# Altium project Analog_SMD_Final.PrjPcb
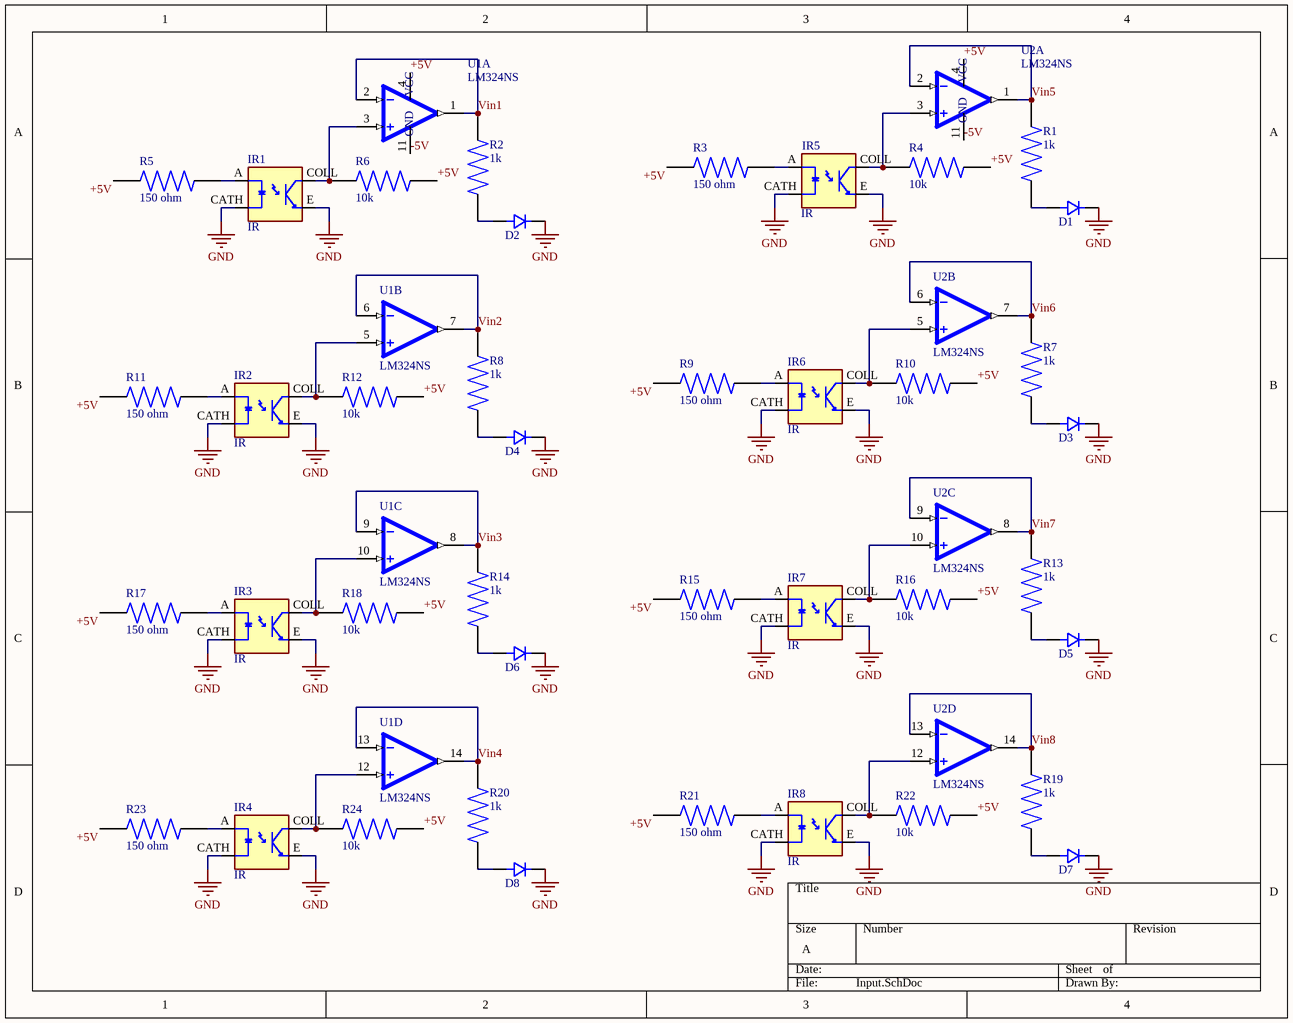
[diagram p0: Input.SchDoc]
6 sheets, 113 parts. Net scope: global (net labels, ports and power ports of the same name join across sheets).
Board file: PCB1.PcbDoc
Sheets:
  Input.SchDoc
  Error_Generator.SchDoc
  PID.SchDoc
  Triangular_Wave.SchDoc
  Motor_Driver.SchDoc
  Regulators.SchDoc

## Sheet Input.SchDoc
size A; SheetNumber: 1; SheetTotal: 6

### Parts
D1  150080RS75000  [150080RS75000]  (value not drawn)
D2  150080RS75000  [150080RS75000]  (value not drawn)
D3  150080RS75000  [150080RS75000]  (value not drawn)
D4  150080RS75000  [150080RS75000]  (value not drawn)
D5  150080RS75000  [150080RS75000]  (value not drawn)
D6  150080RS75000  [150080RS75000]  (value not drawn)
D7  150080RS75000  [150080RS75000]  (value not drawn)
D8  150080RS75000  [150080RS75000]  (value not drawn)
IR1  IR  [OPTO_TCRT5000]
IR2  IR  [OPTO_TCRT5000]
IR3  IR  [OPTO_TCRT5000]
IR4  IR  [OPTO_TCRT5000]
IR5  IR  [OPTO_TCRT5000]
IR6  IR  [OPTO_TCRT5000]
IR7  IR  [OPTO_TCRT5000]
IR8  IR  [OPTO_TCRT5000]
R1  1k  [RESC2012X60N]
R2  1k  [RESC2012X60N]
R3  150 ohm  [RESC2012X60N]
R4  10k  [RESC2012X60N]
R5  150 ohm  [RESC2012X60N]
R6  10k  [RESC2012X60N]
R7  1k  [RESC2012X60N]
R8  1k  [RESC2012X60N]
R9  150 ohm  [RESC2012X60N]
R10  10k  [RESC2012X60N]
R11  150 ohm  [RESC2012X60N]
R12  10k  [RESC2012X60N]
R13  1k  [RESC2012X60N]
R14  1k  [RESC2012X60N]
R15  150 ohm  [RESC2012X60N]
R16  10k  [RESC2012X60N]
R17  150 ohm  [RESC2012X60N]
R18  10k  [RESC2012X60N]
R19  1k  [RESC2012X60N]
R20  1k  [RESC2012X60N]
R21  150 ohm  [RESC2012X60N]
R22  10k  [RESC2012X60N]
R23  150 ohm  [RESC2012X60N]
R24  10k  [RESC2012X60N]
U1  LM324NS  [SOIC127P780X200-14N]  (parts A,B,C,D of 4)
U2  LM324NS  [SOIC127P780X200-14N]  (parts A,B,C,D of 4)

### Nets
GND: D1.2 D2.2 D3.2 D4.2 D5.2 D6.2 D7.2 D8.2 IR1.CATH IR1.E IR2.CATH IR2.E IR3.CATH IR3.E IR4.CATH IR4.E IR5.CATH IR5.E IR6.CATH IR6.E IR7.CATH IR7.E IR8.CATH IR8.E
+5V: R3.1 R4.2 R5.1 R6.2 R9.1 R10.2 R11.1 R12.2 R15.1 R16.2 R17.1 R18.2 R21.1 R22.2 R23.1 R24.2 U1.4(VCC) U2.4(VCC)
-5V: U1.11(GND) U2.11(GND)
Vin1: R2.2 U1.1(1OUT) U1.2(1IN-)
Vin2: R8.2 U1.6(2IN-) U1.7(2OUT)
Vin3: R14.2 U1.8(3OUT) U1.9(3IN-)
Vin4: R20.2 U1.13(4IN-) U1.14(4OUT)
Vin5: R1.2 U2.1(1OUT) U2.2(1IN-)
Vin6: R7.2 U2.6(2IN-) U2.7(2OUT)
Vin7: R13.2 U2.8(3OUT) U2.9(3IN-)
Vin8: R19.2 U2.13(4IN-) U2.14(4OUT)
NetD1_1: D1.1 R1.1
NetD2_1: D2.1 R2.1
NetD3_1: D3.1 R7.1
NetD4_1: D4.1 R8.1
NetD5_1: D5.1 R13.1
NetD6_1: D6.1 R14.1
NetD7_1: D7.1 R19.1
NetD8_1: D8.1 R20.1
NetIR1_A: IR1.A R5.2
NetIR1_COLL: IR1.COLL R6.1 U1.3(1IN+)
NetIR2_A: IR2.A R11.2
NetIR2_COLL: IR2.COLL R12.1 U1.5(2IN+)
NetIR3_A: IR3.A R17.2
NetIR3_COLL: IR3.COLL R18.1 U1.10(3IN+)
NetIR4_A: IR4.A R23.2
NetIR4_COLL: IR4.COLL R24.1 U1.12(4IN+)
NetIR5_A: IR5.A R3.2
NetIR5_COLL: IR5.COLL R4.1 U2.3(1IN+)
NetIR6_A: IR6.A R9.2
NetIR6_COLL: IR6.COLL R10.1 U2.5(2IN+)
NetIR7_A: IR7.A R15.2
NetIR7_COLL: IR7.COLL R16.1 U2.10(3IN+)
NetIR8_A: IR8.A R21.2
NetIR8_COLL: IR8.COLL R22.1 U2.12(4IN+)

### Library data of the parts
IR1-IR8 = IR: 950 nm 60 mA Through Hole Reflective Optical Sensor with Transistor Output; TCRT5000; Availability: Unavailable; MP: TCRT5000; Value: *; Price: None; Package: None
R1 R2 R7 R8 R13 R14 R19 R20 = 1k: 1 kOhms Â±1% 0.125W, 1/8W Chip Resistor 0805 (2012 Metric) Moisture Resistant Thick Film; RC0805FR-071KL; MF: Yageo; DigiKey_Part_Number: 311-1.00KCRTR-ND; Purchase-URL: https://pricing.snapeda.com/search?q=RC0805FR-071KL&ref=eda; Package: 2012 Yageo; Check_prices: https://www.snapeda.com/parts/RC0805FR-071KL/Yageo/view-part/?ref=eda; Value: *; SnapEDA_Link: https://www.snapeda.com/parts/RC0805FR-071KL/Yageo/view-part/?ref=snap; MP: RC0805FR-071KL
R3 R5 R9 R11 R15 R17 R21 R23 = 150 ohm: 150 Ohms Â±1% 0.125W, 1/8W Chip Resistor 0805 (2012 Metric) Moisture Resistant Thick Film; RC0805FR-07150RL; MF: Yageo; SnapEDA_Link: https://www.snapeda.com/parts/RC0805FR-07150RL/Yageo/view-part/?ref=snap; Package: 2012 Yageo; Value: *; MP: RC0805FR-07150RL; Check_prices: https://www.snapeda.com/parts/RC0805FR-07150RL/Yageo/view-part/?ref=eda
R4 R6 R10 R12 R16 R18 R22 R24 = 10k: 10 kOhms Â±1% 0.125W, 1/8W Chip Resistor 0805 (2012 Metric) Moisture Resistant Thick Film; RC0805FR-0710KL; MF: Yageo; Value: *; SnapEDA_Link: https://www.snapeda.com/parts/RC0805FR-0710KL/Yageo/view-part/?ref=snap; Purchase-URL: https://pricing.snapeda.com/search/part/RC0805FR-0710KL/?ref=eda; Availability: In Stock; Price: None; Package: 2012 Rohm Semiconductor; Check_prices: https://www.snapeda.com/parts/RC0805FR-0710KL/Yageo/view-part/?ref=eda; MP: RC0805FR-0710KL
U1 U2 = LM324NS: 4-Channel industry standard operational amplifier 14-SO 0 to 70; LM324NSRG4; MF: Texas Instruments; Purchase-URL: https://pricing.snapeda.com/search/part/LM324NSRG4/?ref=eda; MP: LM324NSRG4; SnapEDA_Link: https://www.snapeda.com/parts/LM324NSRG4/Texas+Instruments/view-part/?ref=snap; Value: *; Package: SOP-14 Texas Instruments; Price: None; Availability: In Stock; Check_prices: https://www.snapeda.com/parts/LM324NSRG4/Texas+Instruments/view-part/?ref=eda

## Sheet Error_Generator.SchDoc
size A; SheetNumber: 2; SheetTotal: 6
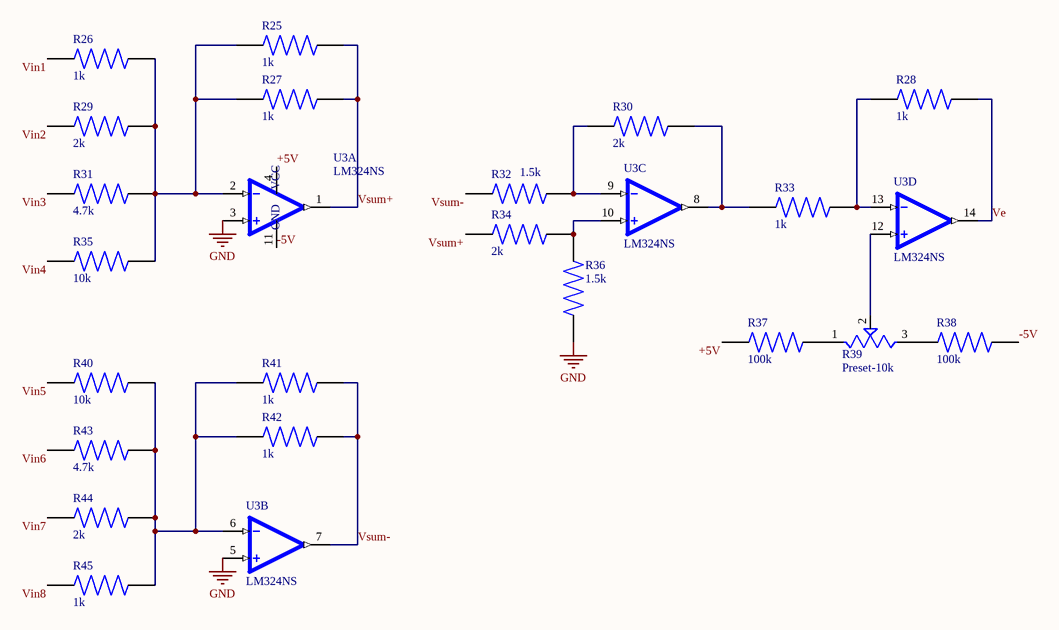
[diagram p1: Error_Generator.SchDoc]

### Parts
R25  1k  [RESC2012X60N]
R26  1k  [RESC2012X60N]
R27  1k  [RESC2012X60N]
R28  1k  [RESC2012X60N]
R29  2k  [RESC2012X60N]
R30  2k  [RESC2012X60N]
R31  4.7k  [RESC2012X60N]
R32  1.5k  [RESC2012X60N]
R33  1k  [RESC2012X60N]
R34  2k  [RESC2012X60N]
R35  10k  [RESC2012X60N]
R36  1.5k  [RESC2012X60N]
R37  100k  [RESC2012X60N]
R38  100k  [RESC2012X60N]
R39  Preset-10k  [TRIM_3306F-1-103]
R40  10k  [RESC2012X60N]
R41  1k  [RESC2012X60N]
R42  1k  [RESC2012X60N]
R43  4.7k  [RESC2012X60N]
R44  2k  [RESC2012X60N]
R45  1k  [RESC2012X60N]
U3  LM324NS  [SOIC127P780X200-14N]  (parts A,B,C,D of 4)

### Nets
GND: R36.1 U3.3(1IN+) U3.5(2IN+)
+5V: R37.1 U3.4(VCC)
-5V: R38.2 U3.11(GND)
Ve: R28.2 U3.14(4OUT)
Vin1: R26.1
Vin2: R29.1
Vin3: R31.1
Vin4: R35.1
Vin5: R40.1
Vin6: R43.1
Vin7: R44.1
Vin8: R45.1
Vsum+: R25.2 R27.2 R34.1 U3.1(1OUT)
Vsum-: R32.1 R41.2 R42.2 U3.7(2OUT)
NetR25_1: R25.1 R26.2 R27.1 R29.2 R31.2 R35.2 U3.2(1IN-)
NetR28_1: R28.1 R33.2 U3.13(4IN-)
NetR30_1: R30.1 R32.2 U3.9(3IN-)
NetR30_2: R30.2 R33.1 U3.8(3OUT)
NetR34_2: R34.2 R36.2 U3.10(3IN+)
NetR37_2: R37.2 R39.1(CCW)
NetR38_1: R38.1 R39.3(CW)
NetR39_2: R39.2(W) U3.12(4IN+)
NetR40_2: R40.2 R41.1 R42.1 R43.2 R44.2 R45.2 U3.6(2IN-)

### Library data of the parts
R25-R28 R33 R41 R42 R45 = 1k: as R1 on sheet Input; DigiKey_Part_Number: 311-1.00KCRTR-ND; Purchase-URL: https://pricing.snapeda.com/search?q=RC0805FR-071KL&ref=eda; Package: 2012 Yageo; Check_prices: https://www.snapeda.com/parts/RC0805FR-071KL/Yageo/view-part/?ref=eda; Value: *; SnapEDA_Link: https://www.snapeda.com/parts/RC0805FR-071KL/Yageo/view-part/?ref=snap; MP: RC0805FR-071KL
R29 R30 R34 R44 = 2k: 2 kOhms Â±1% 0.125W, 1/8W Chip Resistor 0805 (2012 Metric) Moisture Resistant Thick Film; RC0805FR-072KL; MF: Yageo; SnapEDA_Link: https://www.snapeda.com/parts/RC0805FR-072KL/Yageo/view-part/?ref=snap; Package: 2012 Yageo; Value: *; MP: RC0805FR-072KL; Check_prices: https://www.snapeda.com/parts/RC0805FR-072KL/Yageo/view-part/?ref=eda
R31 R43 = 4.7k: 4.7 kOhms Â±1% 0.125W, 1/8W Chip Resistor 0805 (2012 Metric) Moisture Resistant Thick Film; RC0805FR-074K7L; MF: Yageo; Check_prices: https://www.snapeda.com/parts/RC0805FR-074K7L/Yageo/view-part/?ref=eda; Value: *; Availability: In Stock; MP: RC0805FR-074K7L; Price: None; Package: 2012 Rohm Semiconductor; SnapEDA_Link: https://www.snapeda.com/parts/RC0805FR-074K7L/Yageo/view-part/?ref=snap; Purchase-URL: https://pricing.snapeda.com/search/part/RC0805FR-074K7L/?ref=eda
R32 R36 = 1.5k: Res Thin Film 0805 1.5K Ohm 0.1% 0.125W(1/8W) Â±25ppm/C Epoxy Pad SMD T/R; RT0805BRD071K5L; MF: Yageo; SnapEDA_Link: https://www.snapeda.com/parts/RT0805BRD071K5L/Yageo/view-part/?ref=snap; Package: 2012 Yageo; Value: *; MP: RT0805BRD071K5L; Check_prices: https://www.snapeda.com/parts/RT0805BRD071K5L/Yageo/view-part/?ref=eda
R35 R40 = 10k: as R4 on sheet Input; Value: *; SnapEDA_Link: https://www.snapeda.com/parts/RC0805FR-0710KL/Yageo/view-part/?ref=snap; Purchase-URL: https://pricing.snapeda.com/search/part/RC0805FR-0710KL/?ref=eda; Availability: In Stock; Price: None; Package: 2012 Rohm Semiconductor; Check_prices: https://www.snapeda.com/parts/RC0805FR-0710KL/Yageo/view-part/?ref=eda; MP: RC0805FR-0710KL
R37 R38 = 100k: 100 kOhms Â±1% 0.125W, 1/8W Chip Resistor 0805 (2012 Metric) Moisture Resistant Thick Film; RC0805FR-07100KL; MF: Yageo; SnapEDA_Link: https://www.snapeda.com/parts/RC0805FR-07100KL/Yageo/view-part/?ref=snap; Package: 2012 Yageo; Value: *; MP: RC0805FR-07100KL; Check_prices: https://www.snapeda.com/parts/RC0805FR-07100KL/Yageo/view-part/?ref=eda
R39 = Preset: TRIMMER - 6MM ROUND, SINGLE-TURN,CERMET, 10K OHMS | Bourns 3306F-1-103; SnapEDA_Link: https://www.snapeda.com/parts/3306F-1-103/Bourns/view-part/?ref=snap; Package: 3306F Bourns; Value: *; MF: Bourns; MP: 3306F-1-103; Check_prices: https://www.snapeda.com/parts/3306F-1-103/Bourns/view-part/?ref=eda
U3 = LM324NS: as U1 on sheet Input; Purchase-URL: https://pricing.snapeda.com/search/part/LM324NSRG4/?ref=eda; MP: LM324NSRG4; SnapEDA_Link: https://www.snapeda.com/parts/LM324NSRG4/Texas+Instruments/view-part/?ref=snap; Value: *; Package: SOP-14 Texas Instruments; Price: None; Availability: In Stock; Check_prices: https://www.snapeda.com/parts/LM324NSRG4/Texas+Instruments/view-part/?ref=eda

## Sheet PID.SchDoc
size A; SheetNumber: 3; SheetTotal: 6
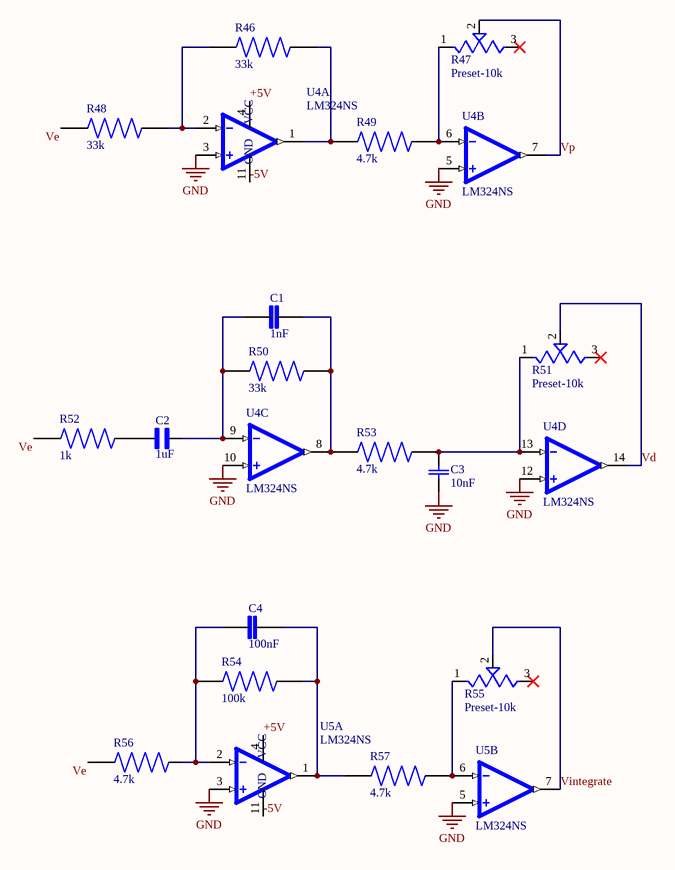
[diagram p2: PID.SchDoc]

### Parts
C1  1nF  [CAPC2012X70]
C2  1uF  [CAPC2012X135N]
C3  10nF  [CAPC2013X110N]
C4  100nF  [CAPC2012X70]
R46  33k  [RESC2012X60N]
R47  Preset-10k  [TRIM_3306F-1-103]
R48  33k  [RESC2012X60N]
R49  4.7k  [RESC2012X60N]
R50  33k  [RESC2012X60N]
R51  Preset-10k  [TRIM_3306F-1-103]
R52  1k  [RESC2012X60N]
R53  4.7k  [RESC2012X60N]
R54  100k  [RESC2012X60N]
R55  Preset-10k  [TRIM_3306F-1-103]
R56  4.7k  [RESC2012X60N]
R57  4.7k  [RESC2012X60N]
U4  LM324NS  [SOIC127P780X200-14N]  (parts A,B,C,D of 4)
U5  LM324NS  [SOIC127P780X200-14N]  (parts A,B of 4)

### Nets
GND: C3.1(C1) U4.3(1IN+) U4.5(2IN+) U4.10(3IN+) U4.12(4IN+) U5.3(1IN+) U5.5(2IN+)
+5V: U4.4(VCC) U5.4(VCC)
-5V: U4.11(GND) U5.11(GND)
Vd: R51.2(W) U4.14(4OUT)
Ve: R48.1 R52.1 R56.1
Vintegrate: R55.2(W) U5.7(2OUT)
Vp: R47.2(W) U4.7(2OUT)
NetC1_1: C1.1 C2.1 R50.1 U4.9(3IN-)
NetC1_2: C1.2 R50.2 R53.1 U4.8(3OUT)
NetC2_2: C2.2 R52.2
NetC3_2: C3.2(C2) R51.1(CCW) R53.2 U4.13(4IN-)
NetC4_1: C4.1 R54.1 R56.2 U5.2(1IN-)
NetC4_2: C4.2 R54.2 R57.1 U5.1(1OUT)
NetR46_1: R46.1 R48.2 U4.2(1IN-)
NetR46_2: R46.2 R49.1 U4.1(1OUT)
NetR47_1: R47.1(CCW) R49.2 U4.6(2IN-)
NetR55_1: R55.1(CCW) R57.2 U5.6(2IN-)

Not connected (* = marked no-connect by the designer): R47 3(CW)*; R51 3(CW)*; R55 3(CW)*

### Library data of the parts
C1 C4 = 1nF: 1000 pF Â±10% 50V Ceramic Capacitor X7R 0805 (2012 Metric); CC0805KRX7R9BB102; MF: Yageo; SnapEDA_Link: https://www.snapeda.com/parts/CC0805KRX7R9BB102/Yageo/view-part/?ref=snap; Package: 0805 Yageo; Value: *; MP: CC0805KRX7R9BB102; Check_prices: https://www.snapeda.com/parts/CC0805KRX7R9BB102/Yageo/view-part/?ref=eda
C2 = 1uF: SMD Capacitor X7R(EIA) with Capacitance: 1.0uF Tol. 10%. Rated Voltage: 25Vdc; GRM21BR71E105KA99L; MF: Murata; SnapEDA_Link: https://www.snapeda.com/parts/GRM21BR71E105KA99L/Murata/view-part/?ref=snap; Package: 2012 Murata; Value: *; MP: GRM21BR71E105KA99L; Check_prices: https://www.snapeda.com/parts/GRM21BR71E105KA99L/Murata/view-part/?ref=eda
C3 = 10nF: 10000 pF Â±10% 50V Ceramic Capacitor X7R 0805 (2012 Metric); CC0805KRX7R9BB103; MF: Yageo; SnapEDA_Link: https://www.snapeda.com/parts/CC0805KRX7R9BB103/Yageo/view-part/?ref=snap; Package: 0805 Yageo; Value: *; MP: CC0805KRX7R9BB103; Check_prices: https://www.snapeda.com/parts/CC0805KRX7R9BB103/Yageo/view-part/?ref=eda
R46 R48 R50 = 33k: 33 kOhms Â±1% 0.125W, 1/8W Chip Resistor 0805 (2012 Metric) Moisture Resistant Thick Film; RC0805FR-0733KL; MF: Yageo; SnapEDA_Link: https://www.snapeda.com/parts/RC0805FR-0733KL/Yageo/view-part/?ref=snap; Package: 2012 Yageo; Value: *; MP: RC0805FR-0733KL; Check_prices: https://www.snapeda.com/parts/RC0805FR-0733KL/Yageo/view-part/?ref=eda
R47 R51 R55 = Preset: as R39 on sheet Error_Generator; SnapEDA_Link: https://www.snapeda.com/parts/3306F-1-103/Bourns/view-part/?ref=snap; Package: 3306F Bourns; Value: *; MF: Bourns; MP: 3306F-1-103; Check_prices: https://www.snapeda.com/parts/3306F-1-103/Bourns/view-part/?ref=eda
R49 R53 R56 R57 = 4.7k: as R31 on sheet Error_Generator; Check_prices: https://www.snapeda.com/parts/RC0805FR-074K7L/Yageo/view-part/?ref=eda; Value: *; Availability: In Stock; MP: RC0805FR-074K7L; Price: None; Package: 2012 Rohm Semiconductor; SnapEDA_Link: https://www.snapeda.com/parts/RC0805FR-074K7L/Yageo/view-part/?ref=snap; Purchase-URL: https://pricing.snapeda.com/search/part/RC0805FR-074K7L/?ref=eda
R52 = 1k: as R1 on sheet Input; DigiKey_Part_Number: 311-1.00KCRTR-ND; Purchase-URL: https://pricing.snapeda.com/search?q=RC0805FR-071KL&ref=eda; Package: 2012 Yageo; Check_prices: https://www.snapeda.com/parts/RC0805FR-071KL/Yageo/view-part/?ref=eda; Value: *; SnapEDA_Link: https://www.snapeda.com/parts/RC0805FR-071KL/Yageo/view-part/?ref=snap; MP: RC0805FR-071KL
R54 = 100k: as R37 on sheet Error_Generator; SnapEDA_Link: https://www.snapeda.com/parts/RC0805FR-07100KL/Yageo/view-part/?ref=snap; Package: 2012 Yageo; Value: *; MP: RC0805FR-07100KL; Check_prices: https://www.snapeda.com/parts/RC0805FR-07100KL/Yageo/view-part/?ref=eda
U4 U5 = LM324NS: as U1 on sheet Input; Purchase-URL: https://pricing.snapeda.com/search/part/LM324NSRG4/?ref=eda; MP: LM324NSRG4; SnapEDA_Link: https://www.snapeda.com/parts/LM324NSRG4/Texas+Instruments/view-part/?ref=snap; Value: *; Package: SOP-14 Texas Instruments; Price: None; Availability: In Stock; Check_prices: https://www.snapeda.com/parts/LM324NSRG4/Texas+Instruments/view-part/?ref=eda

## Sheet Triangular_Wave.SchDoc
size A; SheetNumber: 4; SheetTotal: 6
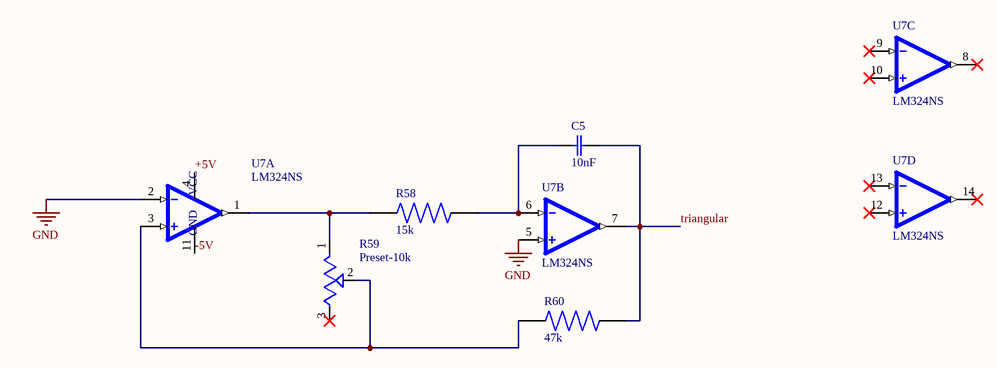
[diagram p3: Triangular_Wave.SchDoc]

### Parts
C5  10nF  [CAPC2013X110N]
R58  15k  [RES_ERA6ARB153V]
R59  Preset-10k  [TRIM_3306F-1-103]
R60  47k  [RESC2012X60N]
U7  LM324NS  [SOIC127P780X200-14N]  (parts A,B,C,D of 4)

### Nets
GND: U7.2(1IN-) U7.5(2IN+)
+5V: U7.4(VCC)
-5V: U7.11(GND)
triangular: C5.2(C2) R60.2 U7.7(2OUT)
NetC5_1: C5.1(C1) R58.2 U7.6(2IN-)
NetR58_1: R58.1 R59.1(CCW) U7.1(1OUT)
NetR59_2: R59.2(W) R60.1 U7.3(1IN+)

Not connected (* = marked no-connect by the designer): R59 3(CW)*; U7 8(3OUT)* 9(3IN-)* 10(3IN+)* 12(4IN+)* 13(4IN-)* 14(4OUT)*

### Library data of the parts
C5 = 10nF: as C3 on sheet PID; SnapEDA_Link: https://www.snapeda.com/parts/CC0805KRX7R9BB103/Yageo/view-part/?ref=snap; Package: 0805 Yageo; Value: *; MP: CC0805KRX7R9BB103; Check_prices: https://www.snapeda.com/parts/CC0805KRX7R9BB103/Yageo/view-part/?ref=eda
R58 = 15k: ERA6ARB153V; Availability: Unavailable; Price: None; Package: None; Value: *; MP: ERA6ARB153V
R59 = Preset: as R39 on sheet Error_Generator; SnapEDA_Link: https://www.snapeda.com/parts/3306F-1-103/Bourns/view-part/?ref=snap; Package: 3306F Bourns; Value: *; MF: Bourns; MP: 3306F-1-103; Check_prices: https://www.snapeda.com/parts/3306F-1-103/Bourns/view-part/?ref=eda
R60 = 47k: 47 kOhms Â±1% 0.125W, 1/8W Chip Resistor 0805 (2012 Metric) Moisture Resistant Thick Film; RC0805FR-0747KL; MF: Yageo; SnapEDA_Link: https://www.snapeda.com/parts/RC0805FR-0747KL/Yageo/view-part/?ref=snap; Package: 2012 Yageo; Value: *; MP: RC0805FR-0747KL; Check_prices: https://www.snapeda.com/parts/RC0805FR-0747KL/Yageo/view-part/?ref=eda
U7 = LM324NS: as U1 on sheet Input; Purchase-URL: https://pricing.snapeda.com/search/part/LM324NSRG4/?ref=eda; MP: LM324NSRG4; SnapEDA_Link: https://www.snapeda.com/parts/LM324NSRG4/Texas+Instruments/view-part/?ref=snap; Value: *; Package: SOP-14 Texas Instruments; Price: None; Availability: In Stock; Check_prices: https://www.snapeda.com/parts/LM324NSRG4/Texas+Instruments/view-part/?ref=eda

## Sheet Motor_Driver.SchDoc
size A; SheetNumber: 5; SheetTotal: 6
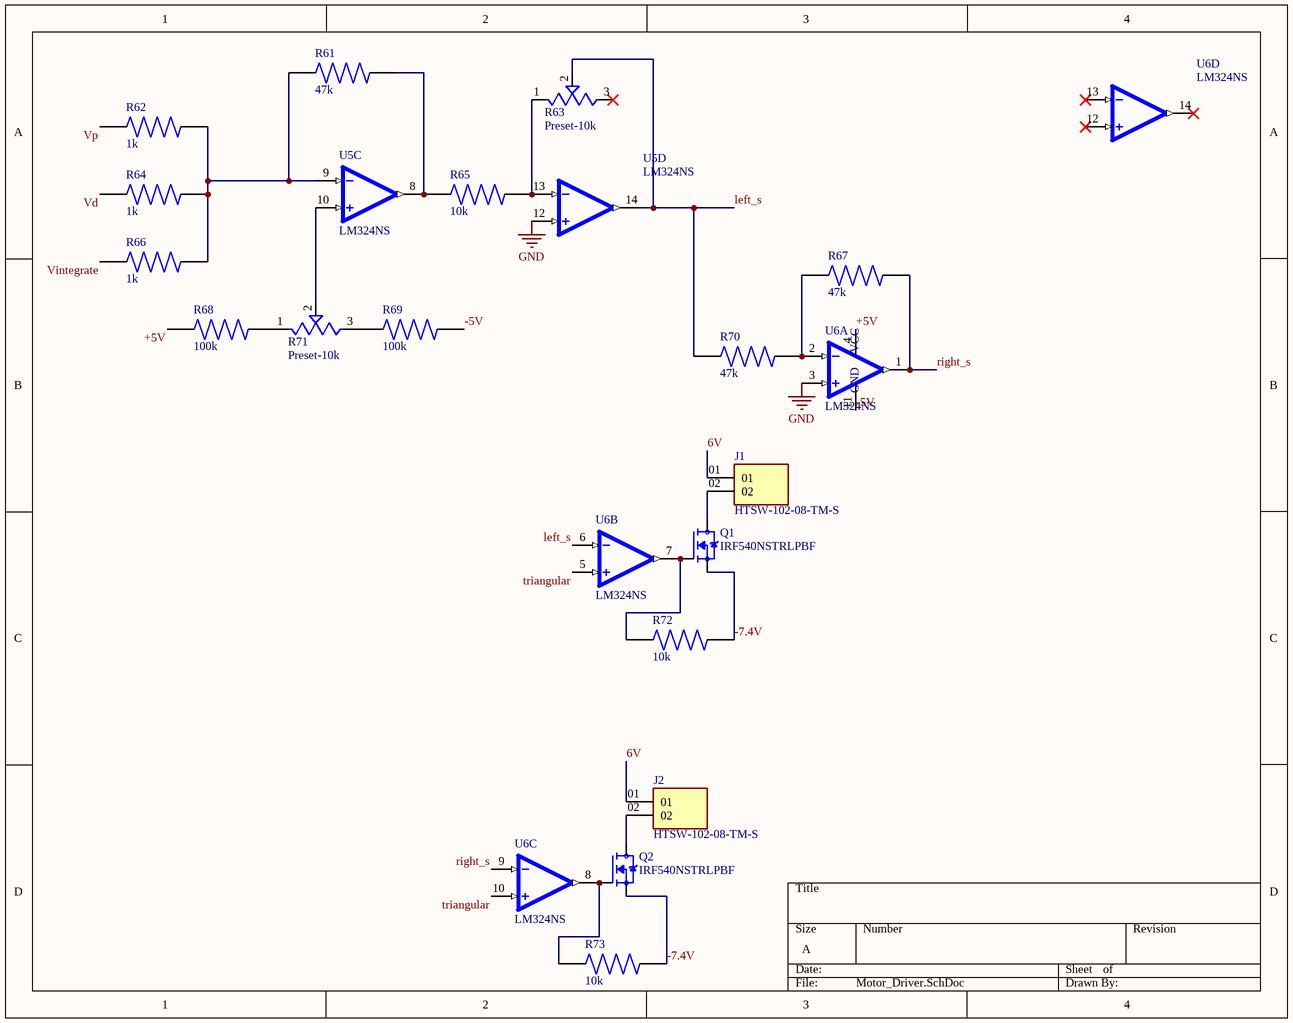
[diagram p4: Motor_Driver.SchDoc]

### Parts
J1  HTSW-102-08-TM-S  [SAMTEC_HTSW-102-08-TM-S]
J2  HTSW-102-08-TM-S  [SAMTEC_HTSW-102-08-TM-S]
Q1  IRF540NSTRLPBF  [TRANS_IRF540NSTRLPBF]
Q2  IRF540NSTRLPBF  [TRANS_IRF540NSTRLPBF]
R61  47k  [RESC2012X60N]
R62  1k  [RESC2012X60N]
R63  Preset-10k  [TRIM_3306F-1-103]
R64  1k  [RESC2012X60N]
R65  10k  [RESC2012X60N]
R66  1k  [RESC2012X60N]
R67  47k  [RESC2012X60N]
R68  100k  [RESC2012X60N]
R69  100k  [RESC2012X60N]
R70  47k  [RESC2012X60N]
R71  Preset-10k  [TRIM_3306F-1-103]
R72  10k  [RESC2012X60N]
R73  10k  [RESC2012X60N]
U5  LM324NS  [SOIC127P780X200-14N]  (parts C,D of 4)
U6  LM324NS  [SOIC127P780X200-14N]  (parts A,B,C,D of 4)

### Nets
GND: U5.12(4IN+) U6.3(1IN+)
6V: J1.01 J2.01
+5V: R68.1 U6.4(VCC)
-5V: R69.2 U6.11(GND)
-7.4V: Q1.3(S) Q2.3(S) R72.2 R73.2
left_s: R63.2(W) R70.1 U5.14(4OUT) U6.6(2IN-)
right_s: R67.2 U6.1(1OUT) U6.9(3IN-)
triangular: U6.5(2IN+) U6.10(3IN+)
Vd: R64.1
Vintegrate: R66.1
Vp: R62.1
NetJ1_02: J1.02 Q1.2(D)
NetJ2_02: J2.02 Q2.2(D)
NetQ1_1: Q1.1(G) R72.1 U6.7(2OUT)
NetQ2_1: Q2.1(G) R73.1 U6.8(3OUT)
NetR61_1: R61.1 R62.2 R64.2 R66.2 U5.9(3IN-)
NetR61_2: R61.2 R65.1 U5.8(3OUT)
NetR63_1: R63.1(CCW) R65.2 U5.13(4IN-)
NetR67_1: R67.1 R70.2 U6.2(1IN-)
NetR68_2: R68.2 R71.1(CCW)
NetR69_1: R69.1 R71.3(CW)
NetR71_2: R71.2(W) U5.10(3IN+)

Not connected (* = marked no-connect by the designer): R63 3(CW)*; U6 12(4IN+)* 13(4IN-)* 14(4OUT)*

### Library data of the parts
J1 J2 = HTSW-102-08-TM-S: HEADER, 2 CONTACTS, 1 ROW, THROUGH HOLE, 2.54 MM; Connector Systems:Board-to-Board; Pitch Spacing:2.54mm; No. of Rows:1Rows; No. of Contacts:2Contacts; Contact Termination Type:Through Hole; Product Range:HTSW Series; Gender:Header RoHS Compliant: Yes; MP: HTSW10208TMS; MF: Samtec; Package: None; Value: *; SnapEDA_Link: https://www.snapeda.com/parts/HTSW10208TMS/Samtec/view-part/?ref=snap; Availability: In Stock; Price: None; Check_prices: https://www.snapeda.com/parts/HTSW10208TMS/Samtec/view-part/?ref=eda
Q1 Q2 = IRF540NSTRLPBF: MOSFET, Power,N-Ch,VDSS 100V,RDS(ON) 44 Milliohms,ID 33A,D2Pak,PD 130W,VGS+/-20V | Infineon IRF540NSTRLPBF; SnapEDA_Link: https://www.snapeda.com/parts/IRF540NSTRLPBF/Infineon/view-part/?ref=snap; Package: D2PAK Infineon; Value: *; MF: Infineon; MP: IRF540NSTRLPBF; Check_prices: https://www.snapeda.com/parts/IRF540NSTRLPBF/Infineon/view-part/?ref=eda
R61 R67 R70 = 47k: as R60 on sheet Triangular_Wave; SnapEDA_Link: https://www.snapeda.com/parts/RC0805FR-0747KL/Yageo/view-part/?ref=snap; Package: 2012 Yageo; Value: *; MP: RC0805FR-0747KL; Check_prices: https://www.snapeda.com/parts/RC0805FR-0747KL/Yageo/view-part/?ref=eda
R62 R64 R66 = 1k: as R1 on sheet Input; DigiKey_Part_Number: 311-1.00KCRTR-ND; Purchase-URL: https://pricing.snapeda.com/search?q=RC0805FR-071KL&ref=eda; Package: 2012 Yageo; Check_prices: https://www.snapeda.com/parts/RC0805FR-071KL/Yageo/view-part/?ref=eda; Value: *; SnapEDA_Link: https://www.snapeda.com/parts/RC0805FR-071KL/Yageo/view-part/?ref=snap; MP: RC0805FR-071KL
R63 R71 = Preset: as R39 on sheet Error_Generator; SnapEDA_Link: https://www.snapeda.com/parts/3306F-1-103/Bourns/view-part/?ref=snap; Package: 3306F Bourns; Value: *; MF: Bourns; MP: 3306F-1-103; Check_prices: https://www.snapeda.com/parts/3306F-1-103/Bourns/view-part/?ref=eda
R65 R72 R73 = 10k: as R4 on sheet Input; Value: *; SnapEDA_Link: https://www.snapeda.com/parts/RC0805FR-0710KL/Yageo/view-part/?ref=snap; Purchase-URL: https://pricing.snapeda.com/search/part/RC0805FR-0710KL/?ref=eda; Availability: In Stock; Price: None; Package: 2012 Rohm Semiconductor; Check_prices: https://www.snapeda.com/parts/RC0805FR-0710KL/Yageo/view-part/?ref=eda; MP: RC0805FR-0710KL
R68 R69 = 100k: as R37 on sheet Error_Generator; SnapEDA_Link: https://www.snapeda.com/parts/RC0805FR-07100KL/Yageo/view-part/?ref=snap; Package: 2012 Yageo; Value: *; MP: RC0805FR-07100KL; Check_prices: https://www.snapeda.com/parts/RC0805FR-07100KL/Yageo/view-part/?ref=eda
U5 U6 = LM324NS: as U1 on sheet Input; Purchase-URL: https://pricing.snapeda.com/search/part/LM324NSRG4/?ref=eda; MP: LM324NSRG4; SnapEDA_Link: https://www.snapeda.com/parts/LM324NSRG4/Texas+Instruments/view-part/?ref=snap; Value: *; Package: SOP-14 Texas Instruments; Price: None; Availability: In Stock; Check_prices: https://www.snapeda.com/parts/LM324NSRG4/Texas+Instruments/view-part/?ref=eda

## Sheet Regulators.SchDoc
size A; SheetNumber: 6; SheetTotal: 6
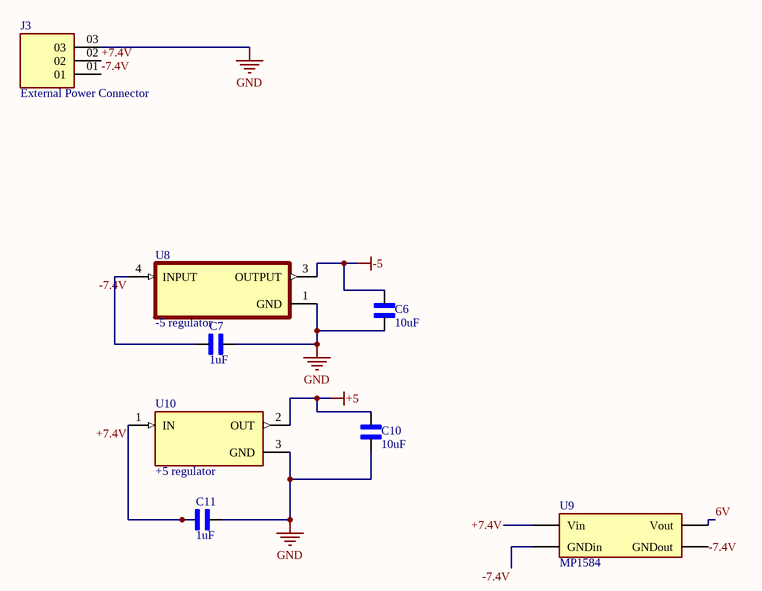
[diagram p5: Regulators.SchDoc]

### Parts
C6  10uF  [CAPC2012X135N]
C7  1uF  [CAPC2012X135N]
C10  10uF  [CAPC2012X135N]
C11  1uF  [CAPC2012X135N]
J3  External Power Connector  [SAMTEC_HTSW-103-XX-X-S]
U8  -5 regulator  [VREG_L7805ACD2T]
U9  MP1584  [MP1584]
U10  +5 regulator  [TO254P1542X460-3N]

### Nets
+5: C10.2 U10.2(OUT)
-5: C6.1 U8.3(OUTPUT)
GND: C6.2 C7.1 C10.1 C11.1 J3.03 U8.1(GND) U10.3(GND)
6V: U9.Vout
+7.4V: C11.2 J3.02 U9.Vin U10.1(IN)
-7.4V: C7.2 J3.01 U8.4(INPUT) U9.GNDin U9.GNDout

### Library data of the parts
C6 C7 C10 C11 = 1uF: as C2 on sheet PID; SnapEDA_Link: https://www.snapeda.com/parts/GRM21BR71E105KA99L/Murata/view-part/?ref=snap; Package: 2012 Murata; Value: *; MP: GRM21BR71E105KA99L; Check_prices: https://www.snapeda.com/parts/GRM21BR71E105KA99L/Murata/view-part/?ref=eda
J3 = HTSW-103-XX-X-S: MF: Samtec; Package: None; Price: None; Value: *; MP: HTSW-103-XX-X-S; Availability: Unavailable
U8 = -5 regulator: Linear Voltage Regulator IC Negative Fixed 1 Output 1.5A D2PAK; L7905CD2T-TR; MF: STMicroelectronics; SnapEDA_Link: https://www.snapeda.com/parts/L7905CD2T-TR/STMicroelectronics/view-part/?ref=snap; Package: TO-263-3 STMicroelectronics; Value: *; MP: L7905CD2T-TR; Check_prices: https://www.snapeda.com/parts/L7905CD2T-TR/STMicroelectronics/view-part/?ref=eda
U10 = +5 regulator: Linear Voltage Regulator IC Positive Fixed 1 Output 1.5A D2PAK; L7805CD2T-TR; MF: STMicroelectronics; SnapEDA_Link: https://www.snapeda.com/parts/L7805CD2T-TR/STMicroelectronics/view-part/?ref=snap; Package: TO-263-3 STMicroelectronics; Value: *; MP: L7805CD2T-TR; Check_prices: https://www.snapeda.com/parts/L7805CD2T-TR/STMicroelectronics/view-part/?ref=eda

## Nets that join several sheets
GND: Input (24 pins), Error_Generator (R36.1 U3.3 U3.5), PID (7 pins), Triangular_Wave (U7.2 U7.5), Motor_Driver (U5.12 U6.3), Regulators (7 pins)
6V: Motor_Driver (J1.01 J2.01), Regulators (U9.Vout)
+5V: Input (18 pins), Error_Generator (R37.1 U3.4), PID (U4.4 U5.4), Triangular_Wave (U7.4), Motor_Driver (R68.1 U6.4)
-5V: Input (U1.11 U2.11), Error_Generator (R38.2 U3.11), PID (U4.11 U5.11), Triangular_Wave (U7.11), Motor_Driver (R69.2 U6.11)
-7.4V: Motor_Driver (Q1.3 Q2.3 R72.2 R73.2), Regulators (5 pins)
triangular: Triangular_Wave (C5.2 R60.2 U7.7), Motor_Driver (U6.5 U6.10)
Vd: PID (R51.2 U4.14), Motor_Driver (R64.1)
Ve: Error_Generator (R28.2 U3.14), PID (R48.1 R52.1 R56.1)
Vin1: Input (R2.2 U1.1 U1.2), Error_Generator (R26.1)
Vin2: Input (R8.2 U1.6 U1.7), Error_Generator (R29.1)
Vin3: Input (R14.2 U1.8 U1.9), Error_Generator (R31.1)
Vin4: Input (R20.2 U1.13 U1.14), Error_Generator (R35.1)
Vin5: Input (R1.2 U2.1 U2.2), Error_Generator (R40.1)
Vin6: Input (R7.2 U2.6 U2.7), Error_Generator (R43.1)
Vin7: Input (R13.2 U2.8 U2.9), Error_Generator (R44.1)
Vin8: Input (R19.2 U2.13 U2.14), Error_Generator (R45.1)
Vintegrate: PID (R55.2 U5.7), Motor_Driver (R66.1)
Vp: PID (R47.2 U4.7), Motor_Driver (R62.1)